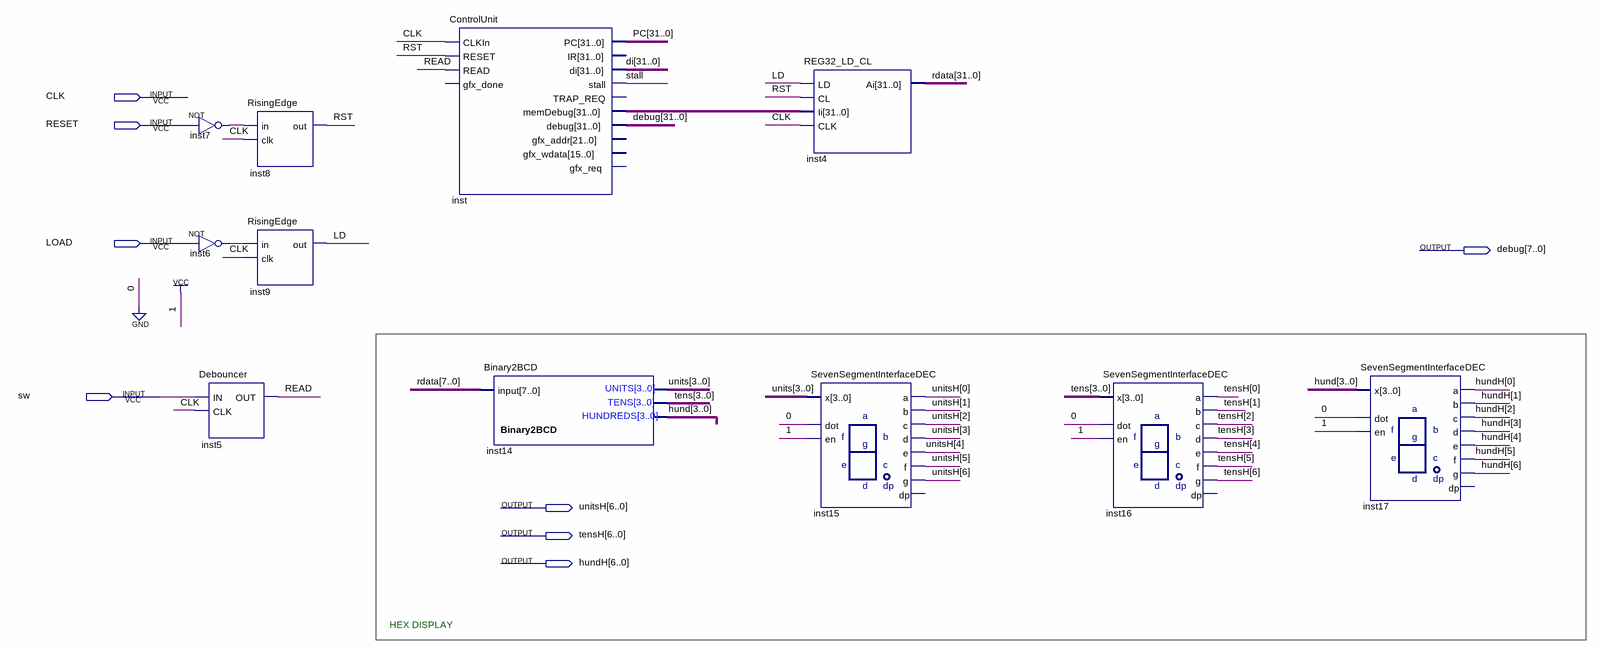
[diagram p0: schematic sheet]
// Quartus schematic UMami-s.bdf as structural Verilog: 11 symbols, 8 pins
module \UMami-s  (
  input  CLK,
  input  RESET,
  input  LOAD,
  input  sw,
  output [31:0] debug,
  output [6:0] unitsH,
  output [6:0] tensH,
  output [6:0] hundH
);

  wire inst6_out, inst7_out, LD, READ, RST, stall;
  wire [3:0] hund, tens, units;
  wire [31:0] di, inst_memdebug, PC, rdata;

  not inst7 (inst7_out, RESET);
  not inst6 (inst6_out, LOAD);
  Debouncer inst5 (.IN(sw), .CLK(CLK), .OUT(READ));
  RisingEdge inst8 (.in(inst7_out), .clk(CLK), .out(RST));
  RisingEdge inst9 (.in(inst6_out), .clk(CLK), .out(LD));
  ControlUnit inst (
    .CLKIn(CLK), .RESET(RST), .READ(READ), .PC(PC), .di(di), .stall(stall), .memDebug(inst_memdebug),
    .debug(debug));  // open: gfx_done, IR, TRAP_REQ, gfx_addr, gfx_wdata, gfx_req
  Binary2BCD inst14 (.\input (rdata[7:0]), .bcd_hundreds(hund), .bcd_tens(tens), .bcd_units(units));
  REG32_LD_CL inst4 (.LD(LD), .CL(RST), .Ii(inst_memdebug), .CLK(CLK), .Ai(rdata));
  SevenSegmentInterfaceDEC inst15 (
    .dot(1'b0), .en(1'b1), .x(units), .a(unitsH[0]), .b(unitsH[1]), .c(unitsH[2]), .d(unitsH[3]),
    .e(unitsH[4]), .f(unitsH[5]), .g(unitsH[6]));  // open: dp
  SevenSegmentInterfaceDEC inst16 (
    .dot(1'b0), .en(1'b1), .x(tens), .a(tensH[0]), .b(tensH[1]), .c(tensH[2]), .d(tensH[3]), .e(tensH[4]),
    .f(tensH[5]), .g(tensH[6]));  // open: dp
  SevenSegmentInterfaceDEC inst17 (
    .dot(1'b0), .en(1'b1), .x(hund), .a(hundH[0]), .b(hundH[1]), .c(hundH[2]), .d(hundH[3]), .e(hundH[4]),
    .f(hundH[5]), .g(hundH[6]));  // open: dp

  // Notes on the sheet:
  //   HEX DISPLAY
endmodule
